# EAGLE schematic sensorSwitchTemplate (EAGLE 9.5.0)
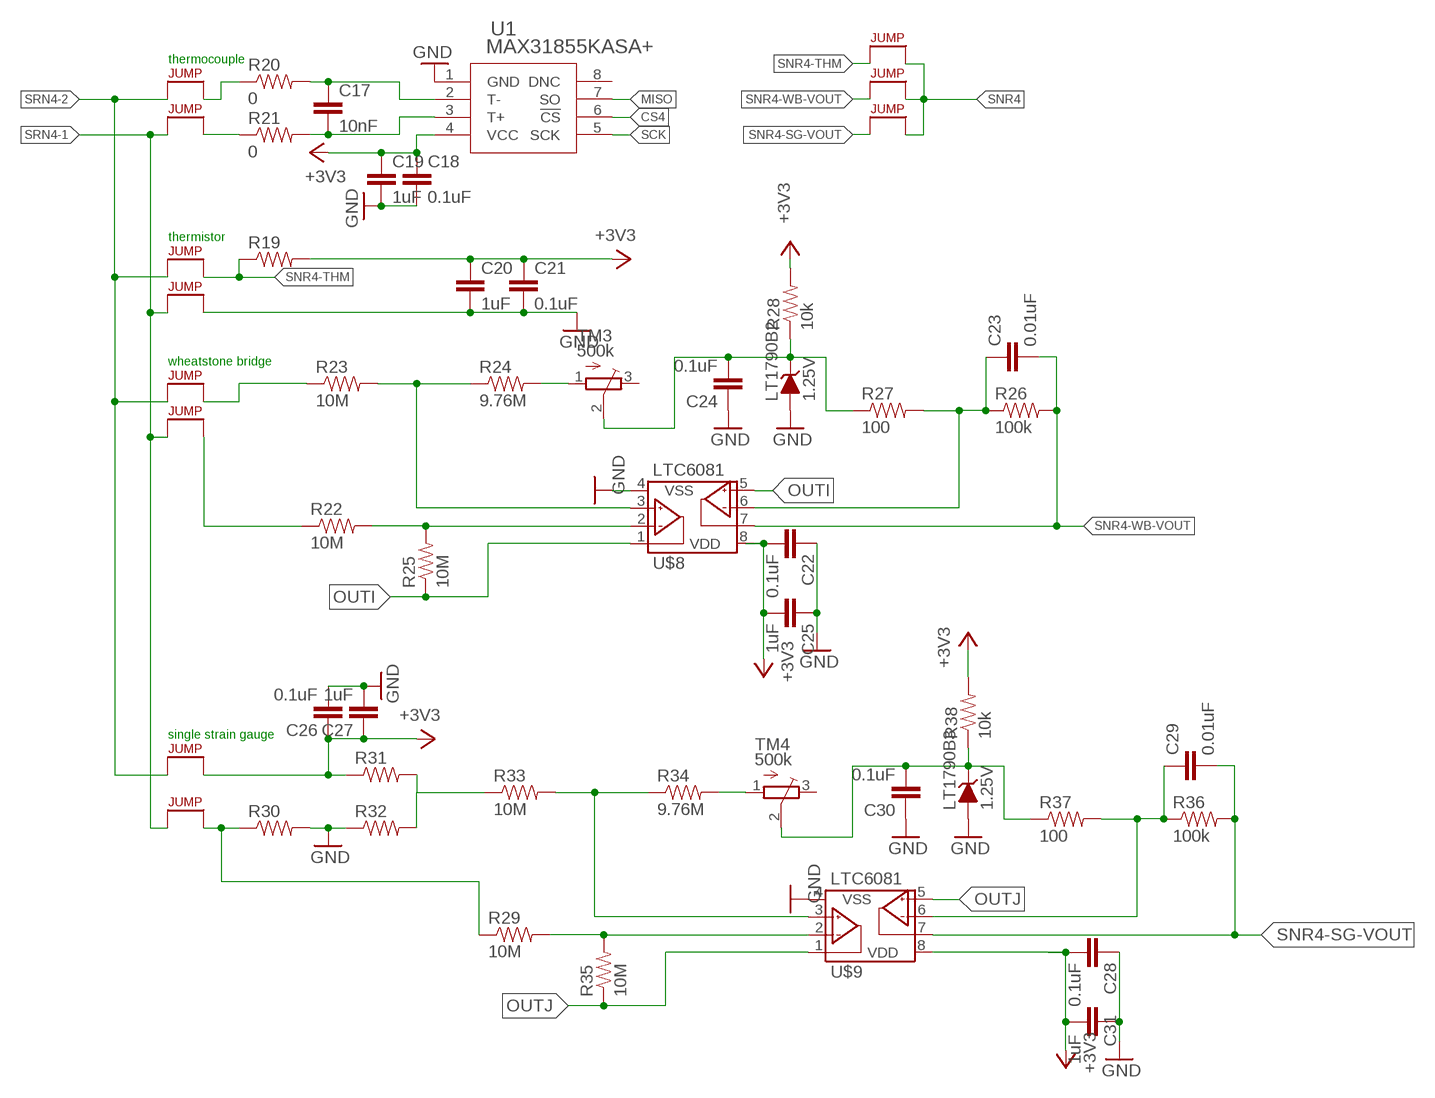
[diagram p0: schematic, sheet 1]

## Parts
C17  10nF  CAP0603-CAP  [0603-CAP]
C18  0.1uF  CAP0603-CAP  [0603-CAP]
C19  1uF  CAP0603-CAP  [0603-CAP]
C20  1uF  CAP0603-CAP  [0603-CAP]
C21  0.1uF  CAP0603-CAP  [0603-CAP]
C22  0.1uF  CAP0805  [0805]
C23  0.01uF  CAP0805  [0805]
C24  0.1uF  CAP0805  [0805]
C25  1uF  CAP0805  [0805]
C26  0.1uF  CAP0603-CAP  [0603-CAP]
C27  1uF  CAP0603-CAP  [0603-CAP]
C28  0.1uF  CAP0805  [0805]
C29  0.01uF  CAP0805  [0805]
C30  0.1uF  CAP0805  [0805]
C31  1uF  CAP0805  [0805]
J1  JUMPER.1  [1X02]
J2  JUMPER.1  [1X02]
J3  JUMPER.1  [1X02]
J4  JUMPER.1  [1X02]
J5  JUMPER.1  [1X02]
J6  JUMPER.1  [1X02]
J7  JUMPER.1  [1X02]
J8  JUMPER.1  [1X02]
J39  JUMPER.1  [1X02]
J40  JUMPER.1  [1X02]
J41  JUMPER.1  [1X02]
LT1790B2  1.25V  DIODE_ZENER0805  [0805_D]
LT1790B3  1.25V  DIODE_ZENER0805  [0805_D]
R19  RESISTOR0603-RES  [0603-RES]
R20  0  RESISTOR0603  [0603-RES]
R21  0  RESISTOR0603  [0603-RES]
R22  10M  RESISTOR0805-RES  [0805]
R23  10M  RESISTOR0805-RES  [0805]
R24  9.76M  RESISTOR0805-RES  [0805]
R25  10M  RESISTOR0805-RES  [0805]
R26  100k  RESISTOR0805-RES  [0805]
R27  100  RESISTOR0805-RES  [0805]
R28  10k  RESISTOR0805-RES  [0805]
R29  10M  RESISTOR0805-RES  [0805]
R30  RESISTOR0603  [0603-RES]
R31  RESISTOR0603  [0603-RES]
R32  RESISTOR0603  [0603-RES]
R33  10M  RESISTOR0805-RES  [0805]
R34  9.76M  RESISTOR0805-RES  [0805]
R35  10M  RESISTOR0805-RES  [0805]
R36  100k  RESISTOR0805-RES  [0805]
R37  100  RESISTOR0805-RES  [0805]
R38  10k  RESISTOR0805-RES  [0805]
TM3  500k  TRIMPOTTC33X  [TC33X]
TM4  500k  TRIMPOTTC33X  [TC33X]
U1  MAX31855KASA+  [21-0041B_8]
U$8  LTC6081  [MSOP-8_MS]
U$9  LTC6081  [MSOP-8_MS]

## Nets
+3V3: C18.1 C19.1 C20.1 C21.1 C22.2 C25.2 C28.2 C31.1 R19.2 R28.2 R38.2 U1.4(VCC) U$8.8(VDD) U$9.8(VDD)
CS4: U1.6(!CS)
GND: C18.2 C19.2 C20.2 C21.2 C22.1 C24.1 C25.1 C26.2 C27.2 C28.1 C30.1 C31.2 J4.2 LT1790B2.A LT1790B3.A R30.2 R32.1 U1.1(GND) U$8.4(VSS) U$9.4(VSS)
INB-2: C23.1 R26.1 R27.2 U$8.6(VINB-)
INB-3: C29.1 R36.1 R37.2 U$9.6(VINB-)
MISO: U1.7(SO)
N$2: C17.1 R20.2 U1.2(T-)
N$6: C17.2 R21.2 U1.3(T+)
N$7: J2.2 R21.1
N$15: J1.2 R20.1
N$16: R22.2 R25.2 U$8.2(VINA-)
N$17: R23.2 R24.1 U$8.3(VINA+)
N$18: C24.2 LT1790B2.C R27.1 R28.1 TM3.2(S)
N$19: R24.2 TM3.1(A)
N$20: C26.1 C27.1 J7.2 R31.1 ; supply symbol labelled +3V3
N$21: J6.2 R22.1
N$22: R31.2 R32.2 R33.1
N$23: J8.2 R29.1 R30.1
N$25: J5.2 R23.1
N$26: R29.2 R35.2 U$9.2(VINA-)
N$27: R33.2 R34.1 U$9.3(VINA+)
N$28: C30.2 LT1790B3.C R37.1 R38.1 TM4.2(S)
N$29: R34.2 TM4.1(A)
OUTI: R25.1 U$8.1(VOUTA) U$8.5(VINB+)
OUTJ: R35.1 U$9.1(VOUTA) U$9.5(VINB+)
SCK: U1.5(SCK)
SNR4: J39.2 J40.2 J41.2
SNR4-SG-VOUT: C29.2 J41.1 R36.2 U$9.7(VOUTB)
SNR4-THM: J3.2 J39.1 R19.1
SNR4-WB-VOUT: C23.2 J40.1 R26.2 U$8.7(VOUTB)
SRN4-1: J2.1 J4.1 J6.1 J8.1
SRN4-2: J1.1 J3.1 J5.1 J7.1
Unconnected: TM3.3(E) TM4.3(E) U1.8(DNC)

## Notes on the sheet
- thermocouple
- thermistor
- wheatstone bridge
- single strain gauge

## Library data of the parts
C17-C31 = HyTechDevices:CAP: Capacitor Standard 0603 ceramic capacitor, and 0.1" leaded capacitor.
J1-J8 J39-J41 = HyTechDevices:JUMPER: Jumper for changing operation of a device
LT1790B2 LT1790B3 = HyTechDevices:DIODE_ZENER: ZENER DIODE
R19-R38 = HyTechDevices:RESISTOR: Resistor Basic schematic elements and footprints for 0603, 1206, and PTH resistors.
TM3 TM4 = HyTechDevices:TRIMPOT: SMT trimmer potentiometer part number TC33X http://www.ladyada.net/library/eagle
U1 = HyTechDevices:MAX31855KASA+; MANUFACTURER_PART_NUMBER: MAX31855KASA+; VENDOR: Maxim Integrated Products
U$8 U$9 = HyTechDevices:LTC6081